# Altium project SSC_Project.PrjPcb
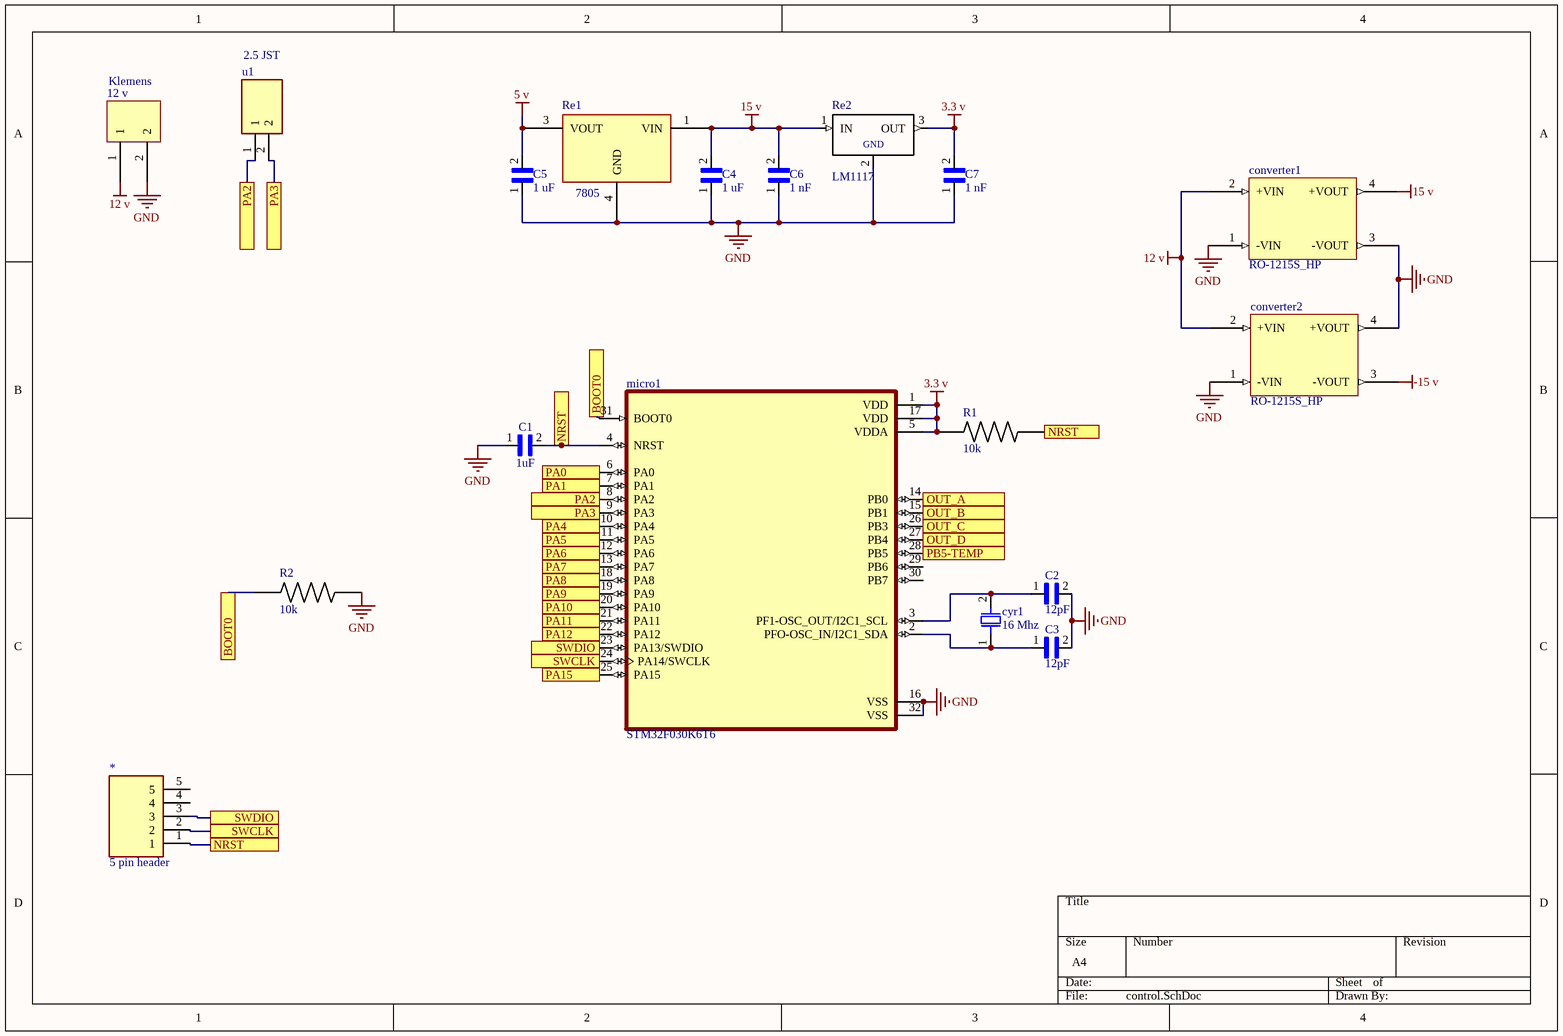
[diagram p0: control.SchDoc]
4 sheets, 161 parts. Net scope: flat (ports and power ports of the same name join across sheets).
Board file: SSC.PcbDoc
Sheets:
  control.SchDoc
  control1.SchDoc
  control2.SchDoc
  Balance.SchDoc

## Sheet control.SchDoc
size A4

### Parts
12_v  Klemens  [Klemens]
*  5 pin header  [5 pin header]
C1  1uF  [12pF capacitor]
C2  12pF  [12pF capacitor]
C3  12pF  [12pF capacitor]
C4  1 uF  [1nF]
C5  1 uF  [1nF]
C6  1 nF  [1nF]
C7  1 nF  [1nF]
converter1  RO-1215S_HP  [RO-1215S_HP]
converter2  RO-1215S_HP  [RO-1215S_HP]
cyr1  16 Mhz  [16 Mhz cyrstal]
micro1  STM32F030K6T6  [STM32F030K6T6]
R1  10k  [Reisitor]
R2  10k  [Reisitor]
Re1  7805  [7805]
Re2  LM1117  [LM1117]
u1  2.5 JST  [2.5 JST]

### Ports
BOOT0, NRST, OUT_A, OUT_B, OUT_C, OUT_D, PA0, PA1, PA2, PA3, PA4, PA5, PA6, PA7, PA8, PA9, PA10, PA11, PA12, PA15, PB5-TEMP, SWCLK, SWDIO

### Nets
3.3 v: C7.2 micro1.1(VDD) micro1.5(VDDA) micro1.17(VDD) R1.1 Re2.3(OUT)
5 v: C5.2 Re1.3(VOUT)
12 v: 12_v.1 converter1.2(+VIN) converter2.2(+VIN)
15 v: C4.2 C6.2 converter1.4(+VOUT) Re1.1(VIN) Re2.1(IN)
-15 v: converter2.3(-VOUT)
GND: 12_v.2 C1.1 C2.2 C3.2 C4.1 C5.1 C6.1 C7.1 converter1.1(-VIN) converter1.3(-VOUT) converter2.1(-VIN) converter2.4(+VOUT) micro1.16(VSS) micro1.32(VSS) R2.2 Re1.4(GND) Re2.2(GND)
Net*_1: *.1 C1.2 micro1.4(NRST) R1.2 ; port NRST
Net*_2: *.2 micro1.24(PA14/SWCLK) ; port SWCLK
Net*_3: *.3 micro1.23(PA13/SWDIO) ; port SWDIO
NetC2_1: C2.1 cyr1.2 micro1.3(PF1-OSC_OUT/I2C1_SCL)
NetC3_1: C3.1 cyr1.1 micro1.2(PFO-OSC_IN/I2C1_SDA)
Netmicro1_6: micro1.6(PA0) ; port PA0
Netmicro1_7: micro1.7(PA1) ; port PA1
Netmicro1_8: micro1.8(PA2) u1.1 ; port PA2
Netmicro1_9: micro1.9(PA3) u1.2 ; port PA3
Netmicro1_10: micro1.10(PA4) ; port PA4
Netmicro1_11: micro1.11(PA5) ; port PA5
Netmicro1_12: micro1.12(PA6) ; port PA6
Netmicro1_13: micro1.13(PA7) ; port PA7
Netmicro1_14: micro1.14(PB0) ; port OUT_A
Netmicro1_15: micro1.15(PB1) ; port OUT_B
Netmicro1_18: micro1.18(PA8) ; port PA8
Netmicro1_19: micro1.19(PA9) ; port PA9
Netmicro1_20: micro1.20(PA10) ; port PA10
Netmicro1_21: micro1.21(PA11) ; port PA11
Netmicro1_22: micro1.22(PA12) ; port PA12
Netmicro1_25: micro1.25(PA15) ; port PA15
Netmicro1_26: micro1.26(PB3) ; port OUT_C
Netmicro1_27: micro1.27(PB4) ; port OUT_D
Netmicro1_28: micro1.28(PB5) ; port PB5-TEMP
Netmicro1_31: micro1.31(BOOT0) R2.1 ; port BOOT0

Not connected (* = marked no-connect by the designer): * 4 5; micro1 29(PB6) 30(PB7)

### Library data of the parts
C1-C3 = 12pF capacitor
C4 C5 = 1 nF
cyr1 = 16 Mhz cyrstal
R1 R2 = resitor

## Sheet control1.SchDoc
size A4
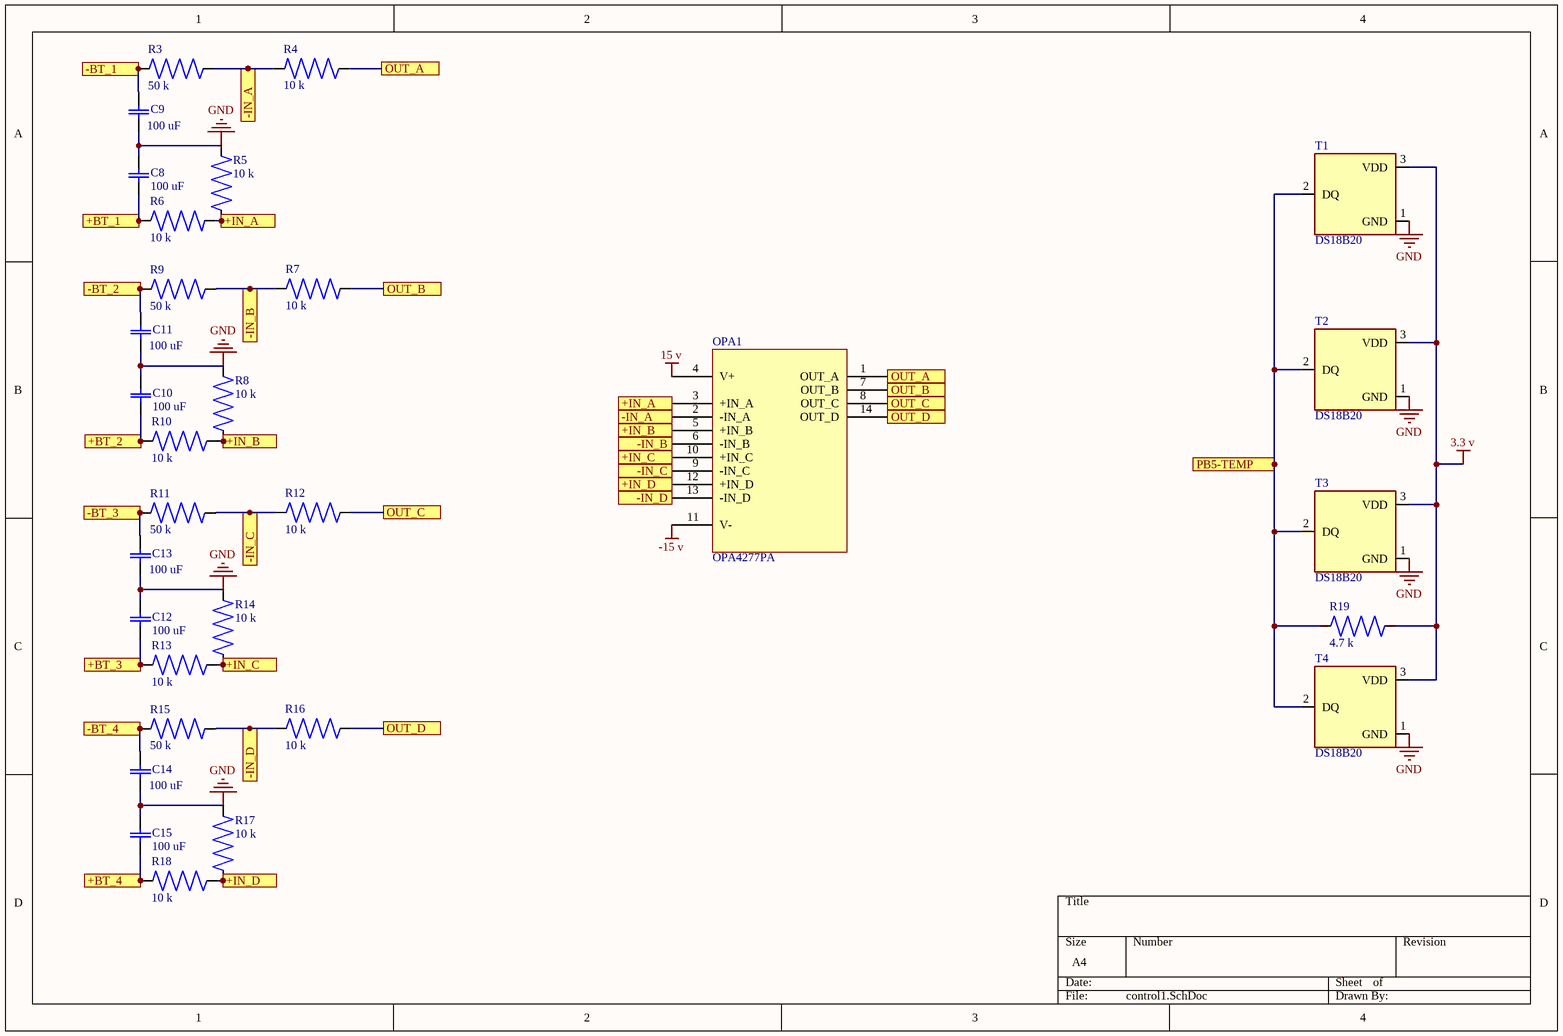
[diagram p1: control1.SchDoc]

### Parts
(Parts that share a designator on the sheet are numbered #1, #2 ... from top to bottom, then left to right.)
C8  100 uF  [0805-c]
C9  100 uF  [0805-c]
C10  100 uF  [0805-c]
C11  100 uF  [0805-c]
C12  100 uF  [0805-c]
C13  100 uF  [0805-c]
C14  100 uF  [0805-c]
C15  100 uF  [0805-c]
OPA1  OPA4277PA  [OPA4277PA]
R3  50 k  [10 k]
R4  10 k  [10 k]
R5  10 k  [10 k]
R6  10 k  [10 k]
R7  10 k  [10 k]
R8  10 k  [10 k]
R9  50 k  [10 k]
R10  10 k  [10 k]
R11  50 k  [10 k]
R12  10 k  [10 k]
R13  10 k  [10 k]
R14  10 k  [10 k]
R15  50 k  [10 k]
R16  10 k  [10 k]
R17  10 k  [10 k]
R18  10 k  [10 k]
R19  4.7 k  [10 k]
T1#1  DS18B20  [DS18B20]
T2#1  DS18B20  [DS18B20]
T3#1  DS18B20  [DS18B20]
T4#1  DS18B20  [DS18B20]

### Ports
+BT_1, +BT_2, +BT_3, +BT_4, +IN_A, +IN_B, +IN_C, +IN_D, -BT_1, -BT_2, -BT_3, -BT_4, -IN_A, -IN_B, -IN_C, -IN_D, OUT_A, OUT_B, OUT_C, OUT_D, PB5-TEMP

### Nets
3.3 v: R19.2 T1#1.3(VDD) T2#1.3(VDD) T3#1.3(VDD) T4#1.3(VDD)
15 v: OPA1.4(V+)
-15 v: OPA1.11(V-)
GND: C8.1(C1) C9.2(C2) C10.1(C1) C11.2(C2) C12.1(C1) C13.2(C2) C14.2(C2) C15.1(C1) R5.1 R8.1 R14.1 R17.1 T1#1.1(GND) T2#1.1(GND) T3#1.1(GND) T4#1.1(GND)
NetBattery1_1: C8.2(C2) R6.2 ; port +BT_1
NetBattery1_2: C9.1(C1) C10.2(C2) R3.1 R10.2 ; port -BT_1, port +BT_2
NetBattery2_2: C11.1(C1) C12.2(C2) R9.1 R13.2 ; port -BT_2, port +BT_3
NetBattery3_2: C13.1(C1) C15.2(C2) R11.1 R18.2 ; port -BT_3, port +BT_4
NetBattery4_2: C14.1(C1) R15.1 ; port -BT_4
Netmicro1_14: OPA1.1(OUT_A) R4.2 ; port OUT_A
Netmicro1_15: OPA1.7(OUT_B) R7.2 ; port OUT_B
Netmicro1_26: OPA1.8(OUT_C) R12.2 ; port OUT_C
Netmicro1_27: OPA1.14(OUT_D) R16.2 ; port OUT_D
Netmicro1_28: R19.1 T1#1.2(DQ) T2#1.2(DQ) T3#1.2(DQ) T4#1.2(DQ) ; port PB5-TEMP
NetOPA1_2: OPA1.2(-IN_A) R3.2 R4.1 ; port -IN_A
NetOPA1_3: OPA1.3(+IN_A) R5.2 R6.1 ; port +IN_A
NetOPA1_5: OPA1.5(+IN_B) R8.2 R10.1 ; port +IN_B
NetOPA1_6: OPA1.6(-IN_B) R7.1 R9.2 ; port -IN_B
NetOPA1_9: OPA1.9(-IN_C) R11.2 R12.1 ; port -IN_C
NetOPA1_10: OPA1.10(+IN_C) R13.1 R14.2 ; port +IN_C
NetOPA1_12: OPA1.12(+IN_D) R17.2 R18.1 ; port +IN_D
NetOPA1_13: OPA1.13(-IN_D) R15.2 R16.1 ; port -IN_D

### Library data of the parts
C8-C15 = 0805-C
R3 R9 R11 R15 R19 = 10 k

## Sheet control2.SchDoc
size A4
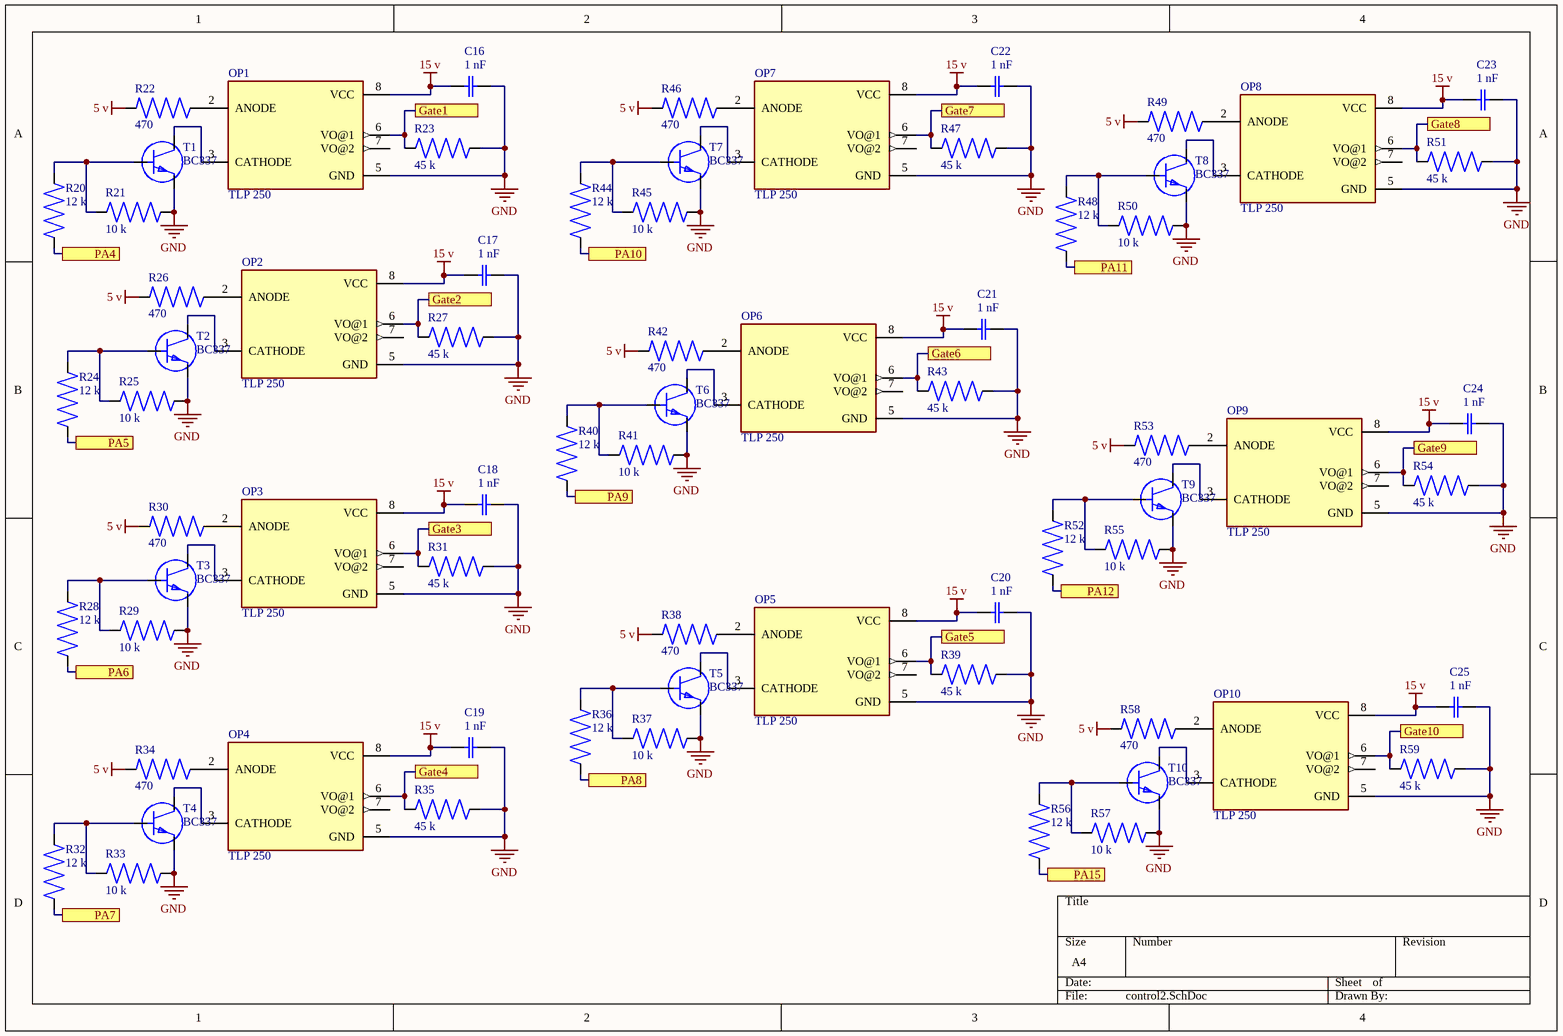
[diagram p2: control2.SchDoc]

### Parts
(Parts that share a designator on the sheet are numbered #1, #2 ... from top to bottom, then left to right.)
C16  1 nF  [0805-c]
C17  1 nF  [0805-c]
C18  1 nF  [0805-c]
C19  1 nF  [0805-c]
C20  1 nF  [0805-c]
C21  1 nF  [0805-c]
C22  1 nF  [0805-c]
C23  1 nF  [0805-c]
C24  1 nF  [0805-c]
C25  1 nF  [0805-c]
OP1  TLP 250  [TLP 250]
OP2  TLP 250  [TLP 250]
OP3  TLP 250  [TLP 250]
OP4  TLP 250  [TLP 250]
OP5  TLP 250  [TLP 250]
OP6  TLP 250  [TLP 250]
OP7  TLP 250  [TLP 250]
OP8  TLP 250  [TLP 250]
OP9  TLP 250  [TLP 250]
OP10  TLP 250  [TLP 250]
R20  12 k  [10 k]
R21  10 k  [10 k]
R22  470  [10 k]
R23  45 k  [10 k]
R24  12 k  [10 k]
R25  10 k  [10 k]
R26  470  [10 k]
R27  45 k  [10 k]
R28  12 k  [10 k]
R29  10 k  [10 k]
R30  470  [10 k]
R31  45 k  [10 k]
R32  12 k  [10 k]
R33  10 k  [10 k]
R34  470  [10 k]
R35  45 k  [10 k]
R36  12 k  [10 k]
R37  10 k  [10 k]
R38  470  [10 k]
R39  45 k  [10 k]
R40  12 k  [10 k]
R41  10 k  [10 k]
R42  470  [10 k]
R43  45 k  [10 k]
R44  12 k  [10 k]
R45  10 k  [10 k]
R46  470  [10 k]
R47  45 k  [10 k]
R48  12 k  [10 k]
R49  470  [10 k]
R50  10 k  [10 k]
R51  45 k  [10 k]
R52  12 k  [10 k]
R53  470  [10 k]
R54  45 k  [10 k]
R55  10 k  [10 k]
R56  12 k  [10 k]
R57  10 k  [10 k]
R58  470  [10 k]
R59  45 k  [10 k]
T1#2  BC337  [BC337]
T2#2  BC337  [BC337]
T3#2  BC337  [BC337]
T4#2  BC337  [BC337]
T5  BC337  [BC337]
T6  BC337  [BC337]
T7  BC337  [BC337]
T8  BC337  [BC337]
T9  BC337  [BC337]
T10  BC337  [BC337]

### Ports
Gate1, Gate2, Gate3, Gate4, Gate5, Gate6, Gate7, Gate8, Gate9, Gate10, PA4, PA5, PA6, PA7, PA8, PA9, PA10, PA11, PA12, PA15

### Nets
5 v: R22.1 R26.1 R30.1 R34.1 R38.1 R42.1 R46.1 R49.1 R53.1 R58.1
15 v: C16.1(C1) C17.1(C1) C18.1(C1) C19.1(C1) C20.1(C1) C21.1(C1) C22.1(C1) C23.1(C1) C24.1(C1) C25.1(C1) OP1.8(VCC) OP2.8(VCC) OP3.8(VCC) OP4.8(VCC) OP5.8(VCC) OP6.8(VCC) OP7.8(VCC) OP8.8(VCC) OP9.8(VCC) OP10.8(VCC)
GND: C16.2(C2) C17.2(C2) C18.2(C2) C19.2(C2) C20.2(C2) C21.2(C2) C22.2(C2) C23.2(C2) C24.2(C2) C25.2(C2) OP1.5(GND) OP2.5(GND) OP3.5(GND) OP4.5(GND) OP5.5(GND) OP6.5(GND) OP7.5(GND) OP8.5(GND) OP9.5(GND) OP10.5(GND) R21.1 R23.1 R25.1 R27.1 R29.1 R31.1 R33.1 R35.1 R37.1 R39.1 R41.1 R43.1 R45.1 R47.1 R50.1 R51.1 R54.1 R55.1 R57.1 R59.1 T1#2.1(E) T2#2.1(E) T3#2.1(E) T4#2.1(E) T5.1(E) T6.1(E) T7.1(E) T8.1(E) T9.1(E) T10.1(E)
NetM1_G: OP6.6(VO@1) R43.2 ; port Gate6
NetM3_G: OP4.6(VO@1) R35.2 ; port Gate4
NetM5_G: OP2.6(VO@1) R27.2 ; port Gate2
NetM7_G: OP1.6(VO@1) R23.2 ; port Gate1
NetM9_G: OP7.6(VO@1) R47.2 ; port Gate7
NetM11_G: OP8.6(VO@1) R51.2 ; port Gate8
NetM13_G: OP9.6(VO@1) R54.2 ; port Gate9
NetM15_G: OP3.6(VO@1) R31.2 ; port Gate3
NetM17_G: OP5.6(VO@1) R39.2 ; port Gate5
NetM19_G: OP10.6(VO@1) R59.2 ; port Gate10
Netmicro1_10: R20.2 ; port PA4
Netmicro1_11: R24.2 ; port PA5
Netmicro1_12: R28.2 ; port PA6
Netmicro1_13: R32.2 ; port PA7
Netmicro1_18: R36.2 ; port PA8
Netmicro1_19: R40.2 ; port PA9
Netmicro1_20: R44.2 ; port PA10
Netmicro1_21: R48.2 ; port PA11
Netmicro1_22: R52.2 ; port PA12
Netmicro1_25: R56.2 ; port PA15
NetOP1_2: OP1.2(ANODE) R22.2
NetOP1_3: OP1.3(CATHODE) T1#2.3(C)
NetOP2_2: OP2.2(ANODE) R26.2
NetOP2_3: OP2.3(CATHODE) T2#2.3(C)
NetOP3_2: OP3.2(ANODE) R30.2
NetOP3_3: OP3.3(CATHODE) T3#2.3(C)
NetOP4_2: OP4.2(ANODE) R34.2
NetOP4_3: OP4.3(CATHODE) T4#2.3(C)
NetOP5_2: OP5.2(ANODE) R38.2
NetOP5_3: OP5.3(CATHODE) T5.3(C)
NetOP6_2: OP6.2(ANODE) R42.2
NetOP6_3: OP6.3(CATHODE) T6.3(C)
NetOP7_2: OP7.2(ANODE) R46.2
NetOP7_3: OP7.3(CATHODE) T7.3(C)
NetOP8_2: OP8.2(ANODE) R49.2
NetOP8_3: OP8.3(CATHODE) T8.3(C)
NetOP9_2: OP9.2(ANODE) R53.2
NetOP9_3: OP9.3(CATHODE) T9.3(C)
NetOP10_2: OP10.2(ANODE) R58.2
NetOP10_3: OP10.3(CATHODE) T10.3(C)
NetR20_1: R20.1 R21.2 T1#2.2(B)
NetR24_1: R24.1 R25.2 T2#2.2(B)
NetR28_1: R28.1 R29.2 T3#2.2(B)
NetR32_1: R32.1 R33.2 T4#2.2(B)
NetR36_1: R36.1 R37.2 T5.2(B)
NetR40_1: R40.1 R41.2 T6.2(B)
NetR44_1: R44.1 R45.2 T7.2(B)
NetR48_1: R48.1 R50.2 T8.2(B)
NetR52_1: R52.1 R55.2 T9.2(B)
NetR56_1: R56.1 R57.2 T10.2(B)

Not connected (* = marked no-connect by the designer): OP1 7(VO@2); OP2 7(VO@2); OP3 7(VO@2); OP4 7(VO@2); OP5 7(VO@2); OP6 7(VO@2); OP7 7(VO@2); OP8 7(VO@2); OP9 7(VO@2); OP10 7(VO@2)

### Library data of the parts
C16-C25 = 0805-C
R20 R22-R24 R26-R28 R30-R32 R34-R36 R38-R40 R42-R44 R46-R49 R51-R54 R56 R58 R59 = 10 k

## Sheet Balance.SchDoc
size A4
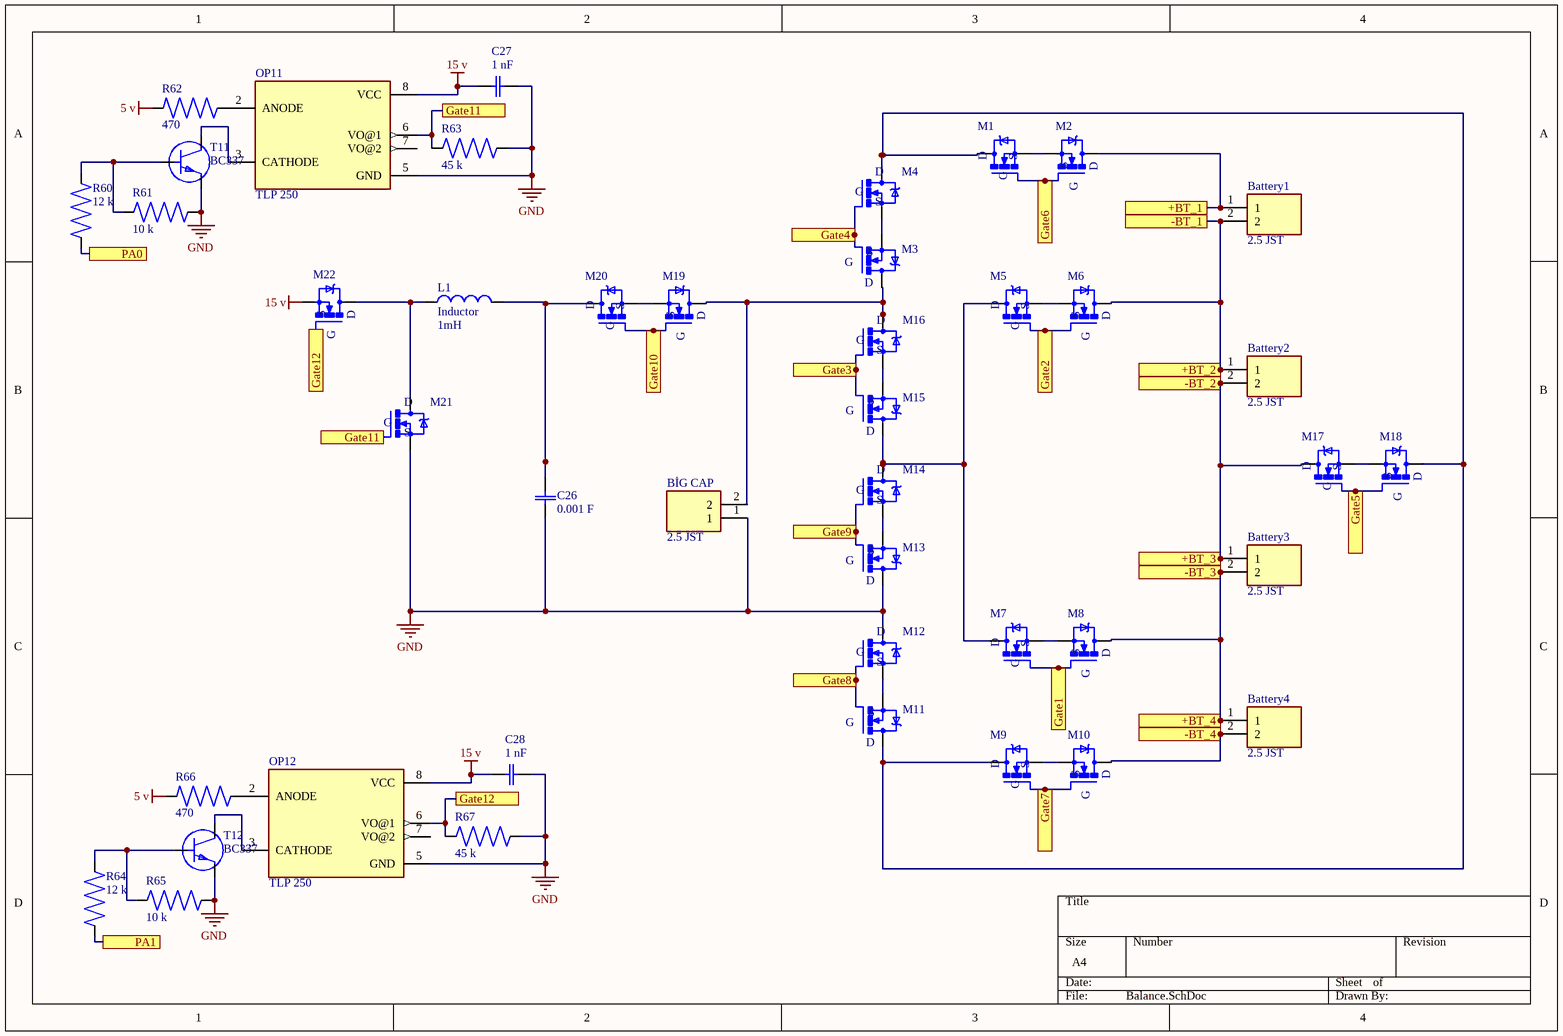
[diagram p3: Balance.SchDoc]

### Parts
Battery1  2.5 JST  [2.5 JST]
Battery2  2.5 JST  [2.5 JST]
Battery3  2.5 JST  [2.5 JST]
Battery4  2.5 JST  [2.5 JST]
BİG_CAP  2.5 JST  [2.5 JST]
C26  0.001 F  [0805-c]
C27  1 nF  [0805-c]
C28  1 nF  [0805-c]
L1  Inductor  value 1mH  [0402-A]
M1  (no value)  [TO-220]
M2  (no value)  [TO-220]
M3  (no value)  [TO-220]
M4  (no value)  [TO-220]
M5  (no value)  [TO-220]
M6  (no value)  [TO-220]
M7  (no value)  [TO-220]
M8  (no value)  [TO-220]
M9  (no value)  [TO-220]
M10  (no value)  [TO-220]
M11  (no value)  [TO-220]
M12  (no value)  [TO-220]
M13  (no value)  [TO-220]
M14  (no value)  [TO-220]
M15  (no value)  [TO-220]
M16  (no value)  [TO-220]
M17  (no value)  [TO-220]
M18  (no value)  [TO-220]
M19  (no value)  [TO-220]
M20  (no value)  [TO-220]
M21  (no value)  [TO-220]
M22  (no value)  [TO-220]
OP11  TLP 250  [TLP 250]
OP12  TLP 250  [TLP 250]
R60  12 k  [10 k]
R61  10 k  [10 k]
R62  470  [10 k]
R63  45 k  [10 k]
R64  12 k  [10 k]
R65  10 k  [10 k]
R66  470  [10 k]
R67  45 k  [10 k]
T11  BC337  [BC337]
T12  BC337  [BC337]

### Ports
+BT_1, +BT_2, +BT_3, +BT_4, -BT_1, -BT_2, -BT_3, -BT_4, Gate1, Gate2, Gate3, Gate4, Gate5, Gate6, Gate7, Gate8, Gate9, Gate10, Gate11, Gate12, PA0, PA1

### Nets
5 v: R62.1 R66.1
15 v: C27.1(C1) C28.1(C1) M22.S OP11.8(VCC) OP12.8(VCC)
GND: BİG_CAP.1 C26.1(C1) C27.2(C2) C28.2(C2) M12.D M13.D M21.S OP11.5(GND) OP12.5(GND) R61.1 R63.1 R65.1 R67.1 T11.1(E) T12.1(E)
NetBattery1_1: Battery1.1 M2.D ; port +BT_1
NetBattery1_2: Battery1.2 Battery2.1 M6.D ; port -BT_1, port +BT_2
NetBattery2_2: Battery2.2 Battery3.1 M17.D ; port -BT_2, port +BT_3
NetBattery3_2: Battery3.2 Battery4.1 M8.D ; port -BT_3, port +BT_4
NetBattery4_2: Battery4.2 M10.D ; port -BT_4
NetBİG_CAP_2: BİG_CAP.2 M3.D M16.D M19.D
NetC26_2: C26.2(C2) L1.2 M20.D
NetL1_1: L1.1 M21.D M22.D
NetM1_D: M1.D M4.D M9.D M11.D M18.D
NetM1_G: M1.G M2.G ; port Gate6
NetM1_S: M1.S M2.S
NetM3_G: M3.G M4.G ; port Gate4
NetM3_S: M3.S M4.S
NetM5_D: M5.D M7.D M14.D M15.D
NetM5_G: M5.G M6.G ; port Gate2
NetM5_S: M5.S M6.S
NetM7_G: M7.G M8.G ; port Gate1
NetM7_S: M7.S M8.S
NetM9_G: M9.G M10.G ; port Gate7
NetM9_S: M9.S M10.S
NetM11_G: M11.G M12.G ; port Gate8
NetM11_S: M11.S M12.S
NetM13_G: M13.G M14.G ; port Gate9
NetM13_S: M13.S M14.S
NetM15_G: M15.G M16.G ; port Gate3
NetM15_S: M15.S M16.S
NetM17_G: M17.G M18.G ; port Gate5
NetM17_S: M17.S M18.S
NetM19_G: M19.G M20.G ; port Gate10
NetM19_S: M19.S M20.S
NetM21_G: M21.G OP11.6(VO@1) R63.2 ; port Gate11
NetM22_G: M22.G OP12.6(VO@1) R67.2 ; port Gate12
Netmicro1_6: R60.2 ; port PA0
Netmicro1_7: R64.2 ; port PA1
NetOP11_2: OP11.2(ANODE) R62.2
NetOP11_3: OP11.3(CATHODE) T11.3(C)
NetOP12_2: OP12.2(ANODE) R66.2
NetOP12_3: OP12.3(CATHODE) T12.3(C)
NetR60_1: R60.1 R61.2 T11.2(B)
NetR64_1: R64.1 R65.2 T12.2(B)

Not connected (* = marked no-connect by the designer): OP11 7(VO@2); OP12 7(VO@2)

### Library data of the parts
C26-C28 = 0805-C
L1 = Inductor: Code_IEC: 1005; Published: 8-Jun-2000; LatestRevisionDate: 29-May-2009; LatestRevisionNote: IPC-7351 Footprint Added.; PackageReference: 0402-A; Publisher: Altium Limited; PackageDescription: Chip Inductor; Code_JEITA: 0402
M1-M22 = TO-220
R60 R62-R64 R66 R67 = 10 k

## Nets that join several sheets
3.3 v: control (6 pins), control1 (5 pins)
5 v: control (C5.2 Re1.3), control2 (10 pins), Balance (R62.1 R66.1)
15 v: control (5 pins), control1 (OPA1.4), control2 (20 pins), Balance (5 pins)
-15 v: control (converter2.3), control1 (OPA1.11)
GND: control (17 pins), control1 (16 pins), control2 (50 pins), Balance (15 pins)
NetBattery1_1: control1 (C8.2 R6.2), Balance (Battery1.1 M2.D)
NetBattery1_2: control1 (C9.1 C10.2 R3.1 R10.2), Balance (Battery1.2 Battery2.1 M6.D)
NetBattery2_2: control1 (C11.1 C12.2 R9.1 R13.2), Balance (Battery2.2 Battery3.1 M17.D)
NetBattery3_2: control1 (C13.1 C15.2 R11.1 R18.2), Balance (Battery3.2 Battery4.1 M8.D)
NetBattery4_2: control1 (C14.1 R15.1), Balance (Battery4.2 M10.D)
NetM1_G: control2 (OP6.6 R43.2), Balance (M1.G M2.G)
NetM3_G: control2 (OP4.6 R35.2), Balance (M3.G M4.G)
NetM5_G: control2 (OP2.6 R27.2), Balance (M5.G M6.G)
NetM7_G: control2 (OP1.6 R23.2), Balance (M7.G M8.G)
NetM9_G: control2 (OP7.6 R47.2), Balance (M9.G M10.G)
NetM11_G: control2 (OP8.6 R51.2), Balance (M11.G M12.G)
NetM13_G: control2 (OP9.6 R54.2), Balance (M13.G M14.G)
NetM15_G: control2 (OP3.6 R31.2), Balance (M15.G M16.G)
NetM17_G: control2 (OP5.6 R39.2), Balance (M17.G M18.G)
NetM19_G: control2 (OP10.6 R59.2), Balance (M19.G M20.G)
Netmicro1_6: control (micro1.6), Balance (R60.2)
Netmicro1_7: control (micro1.7), Balance (R64.2)
Netmicro1_10: control (micro1.10), control2 (R20.2)
Netmicro1_11: control (micro1.11), control2 (R24.2)
Netmicro1_12: control (micro1.12), control2 (R28.2)
Netmicro1_13: control (micro1.13), control2 (R32.2)
Netmicro1_14: control (micro1.14), control1 (OPA1.1 R4.2)
Netmicro1_15: control (micro1.15), control1 (OPA1.7 R7.2)
Netmicro1_18: control (micro1.18), control2 (R36.2)
Netmicro1_19: control (micro1.19), control2 (R40.2)
Netmicro1_20: control (micro1.20), control2 (R44.2)
Netmicro1_21: control (micro1.21), control2 (R48.2)
Netmicro1_22: control (micro1.22), control2 (R52.2)
Netmicro1_25: control (micro1.25), control2 (R56.2)
Netmicro1_26: control (micro1.26), control1 (OPA1.8 R12.2)
Netmicro1_27: control (micro1.27), control1 (OPA1.14 R16.2)
Netmicro1_28: control (micro1.28), control1 (5 pins)